# EAGLE design GucciAux (EAGLE 9.1.0)
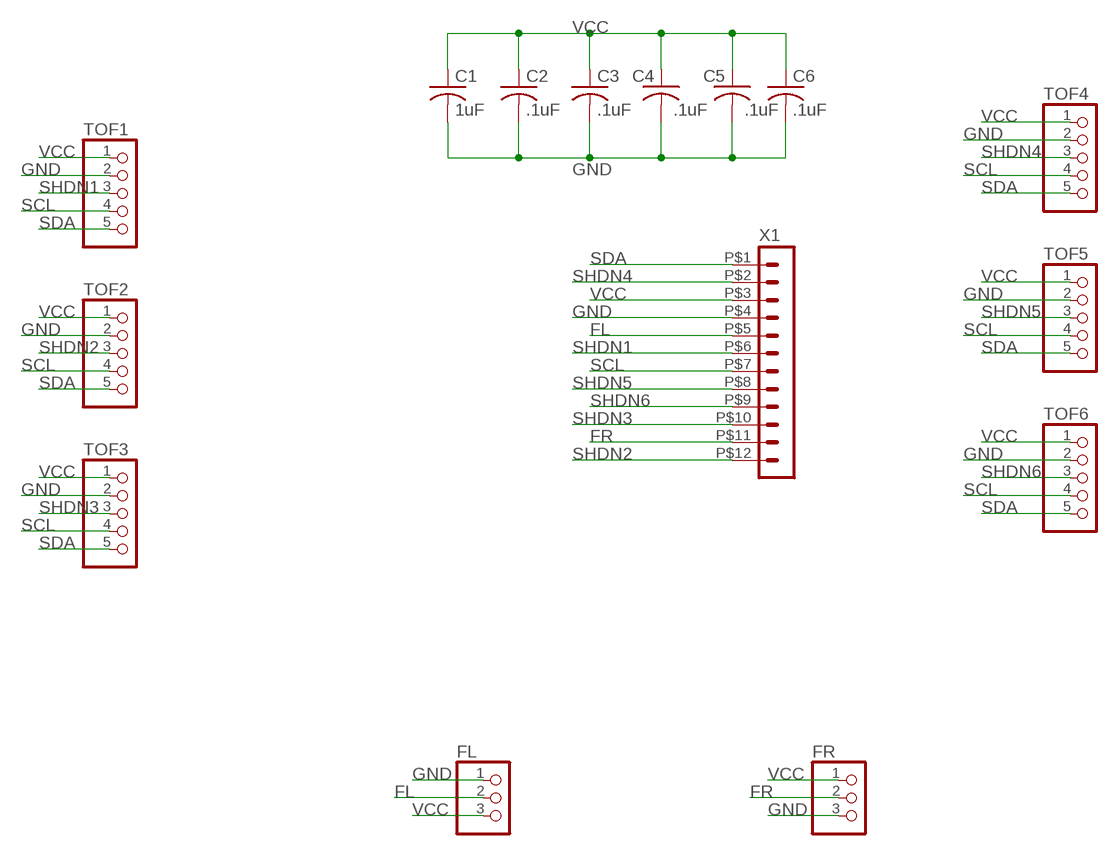
[diagram p0: schematic, sheet 1]

## Parts
C1  1uF  C-USC0402  [C0402]
C2  .1uF  C-USC0402  [C0402]
C3  .1uF  C-USC0402  [C0402]
C4  .1uF  C-USC0402  [C0402]
C5  .1uF  C-USC0402  [C0402]
C6  .1uF  C-USC0402  [C0402]
FL  PINHD-1X3  [1X03]
FR  PINHD-1X3  [1X03]
TOF1  PINHD-1X5  [1X05]
TOF2  PINHD-1X5  [1X05]
TOF3  PINHD-1X5  [1X05]
TOF4  PINHD-1X5  [1X05]
TOF5  PINHD-1X5  [1X05]
TOF6  PINHD-1X5  [1X05]
X1  HEADER_POS12_43045-1212  [43045-1212]

## Nets
FL: FL.2 X1.P$5
FR: FR.2 X1.P$11
GND: C1.2 C2.2 C3.2 C4.2 C5.2 C6.2 FL.1 FR.3 TOF1.2 TOF2.2 TOF3.2 TOF4.2 TOF5.2 TOF6.2 X1.P$4
SCL: TOF1.4 TOF2.4 TOF3.4 TOF4.4 TOF5.4 TOF6.4 X1.P$7
SDA: TOF1.5 TOF2.5 TOF3.5 TOF4.5 TOF5.5 TOF6.5 X1.P$1
SHDN1: TOF1.3 X1.P$6
SHDN2: TOF2.3 X1.P$12
SHDN3: TOF3.3 X1.P$10
SHDN4: TOF4.3 X1.P$2
SHDN5: TOF5.3 X1.P$8
SHDN6: TOF6.3 X1.P$9
VCC: C1.1 C2.1 C3.1 C4.1 C5.1 C6.1 FL.3 FR.1 TOF1.1 TOF2.1 TOF3.1 TOF4.1 TOF5.1 TOF6.1 X1.P$3

## Library data of the parts
C1-C6 = rcl:C-US: CAPACITOR, American symbol; SPICEPREFIX: C
FL FR = pinhead:PINHD-1X3: PIN HEADER
TOF1-TOF6 = pinhead:PINHD-1X5: PIN HEADER
X1 = con-molex-micro-fit-3_0:HEADER_POS12_?: Molex - Micro-Fit 3.0 Series connector, 3.00mm (0.118") pitch header, 12 positions.

## Board
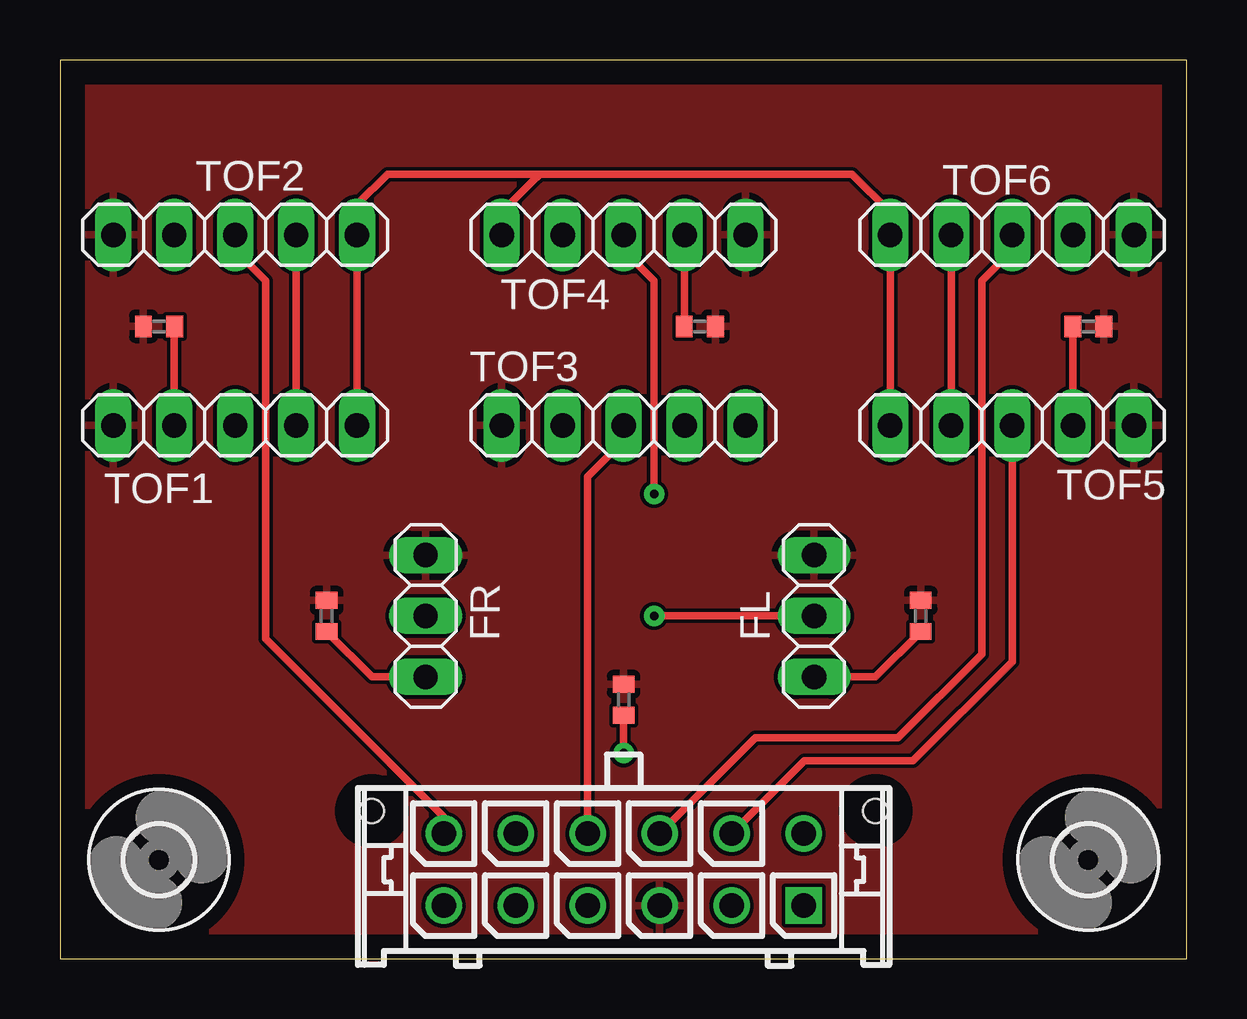
[diagram p1: board, top side]
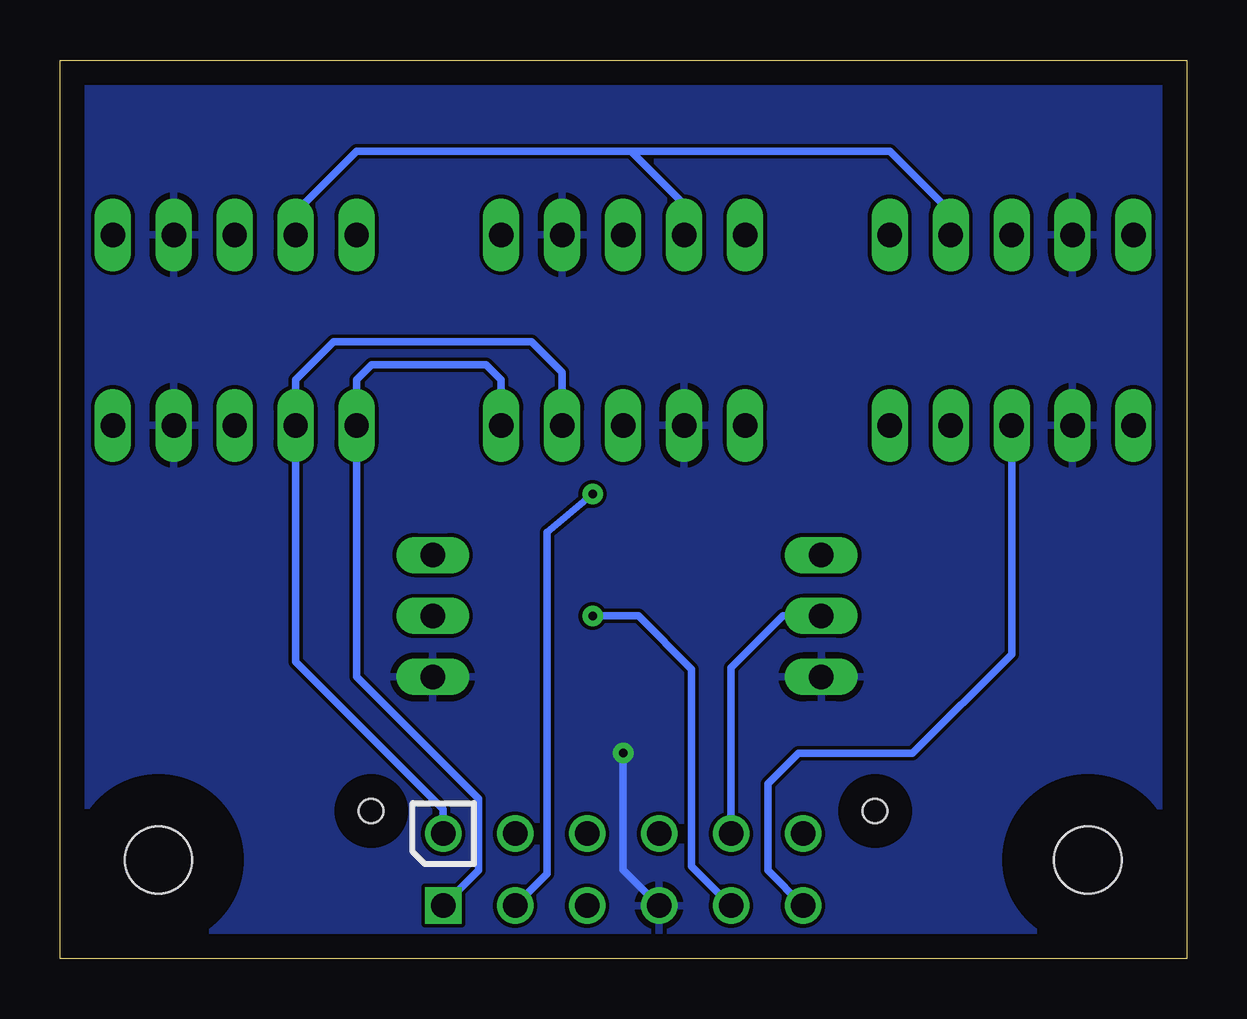
[diagram p2: board, bottom side, seen from below]

Size 46.97 x 37.45 mm. Coordinates in mm from the lower left corner, seen from the top.
Outline: 0,0 46.97,0 46.97,37.45 0,37.45 0,0
Copper layers (1*16): Top 0.035mm / dielectric 1.5mm / Bottom 0.035mm
Design rules "Gucci_DRC *": minimum track width 6mil, minimum drill 0.35mm, track to track 6mil, track to pad 6mil, pad to pad 6mil, via to via 6mil, smd to smd 6mil, copper to edge 40mil, drill to drill 6mil, minimum pad ring 10mil, minimum via ring 10mil, stop-mask expansion 4mil, vias tented up to drill 15mil, thermal gap 10mil

### Footprints (pad centres in the part's own frame; a part is rotated, then mirrored left to right if it is on the bottom)
C0402 = smd 0.7 x 0.9: 1 -0.65,0; 2 0.65,0
1X03 = drill 1.016 long: 1 -2.54,0; 2 0,0; 3 2.54,0
1X05 = drill 1.016 long: 1 -5.08,0; 2 -2.54,0; 3 0,0; 4 2.54,0; 5 5.08,0
2,8 = hole 2.8: 0,0
43045-1212 = drill 1.02 square: P$1 7.5,0 | drill 1.02: P$2 4.5,0; P$3 1.5,0; P$4 -1.5,0; P$5 -4.5,0; P$6 -7.5,0; P$7 7.5,3; P$8 4.5,3; P$9 1.5,3; P$10 -1.5,3; P$11 -4.5,3; P$12 -7.5,3 | hole 1.02: 10.5,3.94; -10.5,3.94

### Placement (x,y rotation side)
C1  23.5,10.79 270 top
C2  35.88,14.29 270 top
C3  42.86,26.35 180 top
C4  4.13,26.35 0 top
C5  26.67,26.35 180 top
C6  11.11,14.29 270 top
FL  31.43,14.29 90 top
FR  15.24,14.29 270 top
TOF1  7.3,22.23 0 top
TOF2  7.3,30.16 0 top
TOF3  23.5,22.23 0 top
TOF4  23.5,30.16 180 top
TOF5  39.69,22.23 180 top
TOF6  39.69,30.16 180 top
U$3  [2,8]  4.13,4.13 0 top
U$4  [2,8]  42.86,4.13 0 top
X1  23.5,2.22 0 top

### Tracks (layer width: path | path; a pad name or v marks a point on that pad's centre or on a via)
FL  (via drill 0.35)
  Top 0.305: FL.2 v24.77,14.29
  Bottom 0.305: X1.P$5 20.64,3.87 20.64,12.06 22.86,14.29 v24.77,14.29
FR
  Bottom 0.305: X1.P$11 19,12.12 16.83,14.29 FR.2
GND  (via drill 0.35)
  Top 0.305: C6.2 13,11.75 FR.3 | TOF1.2 4.76,26.34 C4.2 | TOF5.2 42.23,26.34 C3.2 | FL.1 33.99,11.75 C2.2 | TOF4.2 26.04,26.37 C5.2 | v23.5,8.57 C1.2
  Bottom 0.305: v23.5,8.57 23.5,3.72 X1.P$4
  pour Bottom: 0,0 46.99,-0.13 47,37.43 0.09,37.36
SCL
  Top 0.305: TOF1.4 TOF2.4 | TOF6.4 TOF5.4
  Bottom 0.305: TOF2.4 9.84,31.11 12.38,33.66 23.18,33.66 | TOF6.4 37.15,31.11 34.61,33.66 23.18,33.66 | TOF4.4 20.95,31.43 22.86,33.34 23.18,33.66 | X1.P$7 31,6.23 37.15,12.38 TOF5.4 37.15,24.13 35.56,25.72 27.3,25.72 26.04,24.45 TOF3.4
SDA
  Top 0.305: TOF1.5 TOF2.5 12.38,31.43 13.65,32.7 20,32.7 | TOF5.5 TOF6.5 34.61,31.11 33.02,32.7 20,32.7 | TOF4.5 18.41,31.11 19.68,32.38 20,32.7
  Bottom 0.305: X1.P$1 29.53,3.69 29.53,6.67 34.61,11.75 TOF5.5 34.61,24.13 33.97,24.77 29.21,24.77 28.57,24.13 TOF3.5
SHDN1
  Bottom 0.305: TOF1.3 7.3,12.7 11.43,8.57 16.19,8.57 17.46,7.3 17.46,3.69 X1.P$6
SHDN2
  Top 0.305: X1.P$12 15.99,5.91 8.57,13.34 8.57,28.26 7.3,29.53 TOF2.3
SHDN3
  Top 0.305: X1.P$10 22,20.09 23.5,21.59 TOF3.3
SHDN4  (via drill 0.35)
  Top 0.305: v24.77,19.37 24.77,28.26 23.5,29.53 TOF4.3
  Bottom 0.305: X1.P$2 26.67,3.55 26.67,17.78 v24.77,19.37
SHDN5
  Top 0.305: X1.P$8 31.03,8.26 35.56,8.26 39.69,12.38 TOF5.3
SHDN6
  Top 0.305: X1.P$9 28.98,9.21 34.92,9.21 38.42,12.7 38.42,28.26 39.69,29.53 TOF6.3
VCC
  pour Top: 0,37.47 0.08,0 46.89,-0.03 46.99,37.6